# EAGLE design Wemos-ESP8266_MAX7219 v5 (EAGLE 9.6.2)
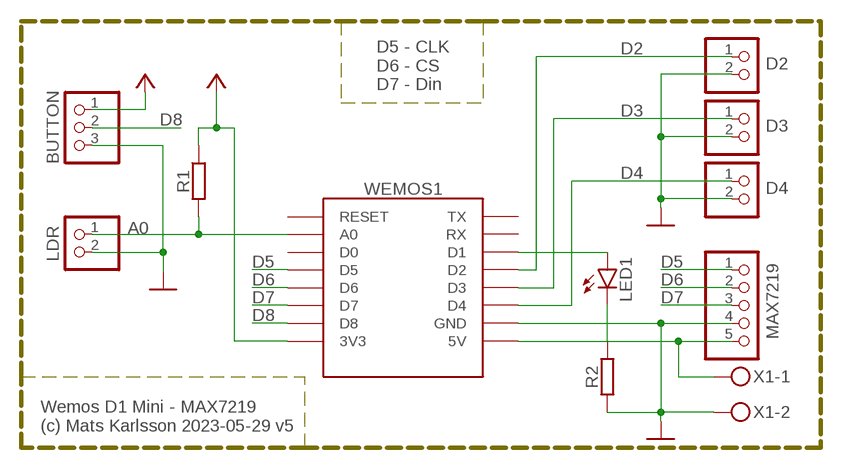
[diagram p0: schematic, sheet 1]

## Parts
BUTTON  PINHD-1X3  [1X03]
D2  PINHD-1X2  [1X02]
D3  PINHD-1X2  [1X02]
D4  PINHD-1X2  [1X02]
LDR  PINHD-1X2  [1X02]
LED1  LEDCHIPLED_1206  [CHIPLED_1206]
MAX7219  PINHD-1X5  [1X05]
R1  R-EU_M0805  [M0805]
R2  R-EU_M0805  [M0805]
WEMOS1  WEMOS-D1-MINI  [WEMOS-D1-MINI]
X1  W237-102  [W237-102]

## Nets
5V: MAX7219.5 WEMOS1.5V X1.1
A0: LDR.1 R1.2 WEMOS1.A0
D2: D2.1 WEMOS1.D2
D3: D3.1 WEMOS1.D3
D4: D4.1 WEMOS1.D4
D5: MAX7219.1 WEMOS1.D5
D6: MAX7219.2 WEMOS1.D6
D7: MAX7219.3 WEMOS1.D7
D8: BUTTON.2 WEMOS1.D8
GND: BUTTON.3 D2.2 D3.2 D4.2 LDR.2 MAX7219.4 R2.2 WEMOS1.GND X1.2
N$1: LED1.C R2.1
N$2: LED1.A WEMOS1.D1
VCC: BUTTON.1 R1.1 WEMOS1.3V3
Unconnected: WEMOS1.D0 WEMOS1.RESET WEMOS1.RX WEMOS1.TX

## Notes on the sheet
- D5 - CLK
  D6 - CS
  D7 - Din
- Wemos D1 Mini - MAX7219
  (c) Mats Karlsson 2023-05-29 v5

## Library data of the parts
BUTTON = pinhead:PINHD-1X3: PIN HEADER
D2-D4 LDR = pinhead:PINHD-1X2: PIN HEADER
LED1 = led:LED: LED OSRAM: - CHIPLED LG R971, LG N971, LY N971, LG Q971, LY Q971, LO R971, LY R971 LH N974, LH R974 LS Q976, LO Q976, LY Q976 LO Q996 - Hyper CHIPLED LW Q18S LB Q993, LB Q99A, LB R99A - SideLED LS A670, LO A670, LY A670, LG A670, LP A670 LB A673, LV A673, LT A673, LW A673 LH A674 LY A675 LS A676, LA A676, LO A676, LY A676, LW A676 LS A679, LY A679, LG A679 - Hyper Micro SIDELED® LS Y876, LA Y876, LO Y876, LY Y876 LT Y87S - SmartLED LW L88C, LW L88S LB L89C, LB L89S, LG L890 LS L89K, LO L89K, LY L89K LS L896, LA L896, LO L896, LY L896 - TOPLED LS T670, LO T670, LY T670, LG T670, LP T670 LSG T670, LSP T670, LSY T670, LOP T670, LYG T670 LG T671, LOG T671, LSG T671 LB T673, LV T673, LT T673, LW T673 LH T674 LS T676, LA T676, LO T676, LY T676, LB T676, LH T676, LSB T676, LW T676 LB T67C, LV T67C, LT T67C, LS T67K, LO T67K, LY T67K, LW E67C LS E67B, LA E67B, LO E67B, LY E67B, LB E67C, LV E67C, LT E67C LW T67C LS T679, LY T679, LG T679 LS T770, LO T770, LY T770, LG T770, LP T770 LB T773, LV T773, LT T773, LW T773 LH T774 LS E675, LA E675, LY E675, LS T675 LS T776, LA T776, LO T776, LY T776, LB T776 LHGB T686 LT T68C, LB T68C - Hyper Mini TOPLED® LB M676 - Mini TOPLED Santana® LG M470 LS M47K, LO M47K, LY M47K Source: http://www.osram.convergy.de LUXEON: - LUMILED® LXK2-PW12-R00, LXK2-PW12-S00, LXK2-PW14-U00, LXK2-PW14-V00 LXK2-PM12-R00, LXK2-PM12-S00, LXK2-PM14-U00 LXK2-PE12-Q00, LXK2-PE12-R00, LXK2-PE12-S00, LXK2-PE14-T00, LXK2-PE14-U00 LXK2-PB12-K00, LXK2-PB12-L00, LXK2-PB12-M00, LXK2-PB14-N00, LXK2-PB14-P00, LXK2-PB14-Q00 LXK2-PR12-L00, LXK2-PR12-M00, LXK2-PR14-Q00, LXK2-PR14-R00 LXK2-PD12-Q00, LXK2-PD12-R00, LXK2-PD12-S00 LXK2-PH12-R00, LXK2-PH12-S00 LXK2-PL12-P00, LXK2-PL12-Q00, LXK2-PL12-R00 Source: www.luxeon.com KINGBRIGHT: KA-3528ASYC Source: www.kingbright.com
MAX7219 = pinhead:PINHD-1X5: PIN HEADER
R1 R2 = rcl:R-EU_: RESISTOR, European symbol; SPICEPREFIX: R
WEMOS1 = esp8266modules:WEMOS-D1-MINI: WeMos.cc D1 mini ESP8266 module
X1 = con-wago-500:W237-102: WAGO SCREW CLAMP; MPN: 237-102; OC_FARNELL: unknown; OC_NEWARK: 70K9898

## Board
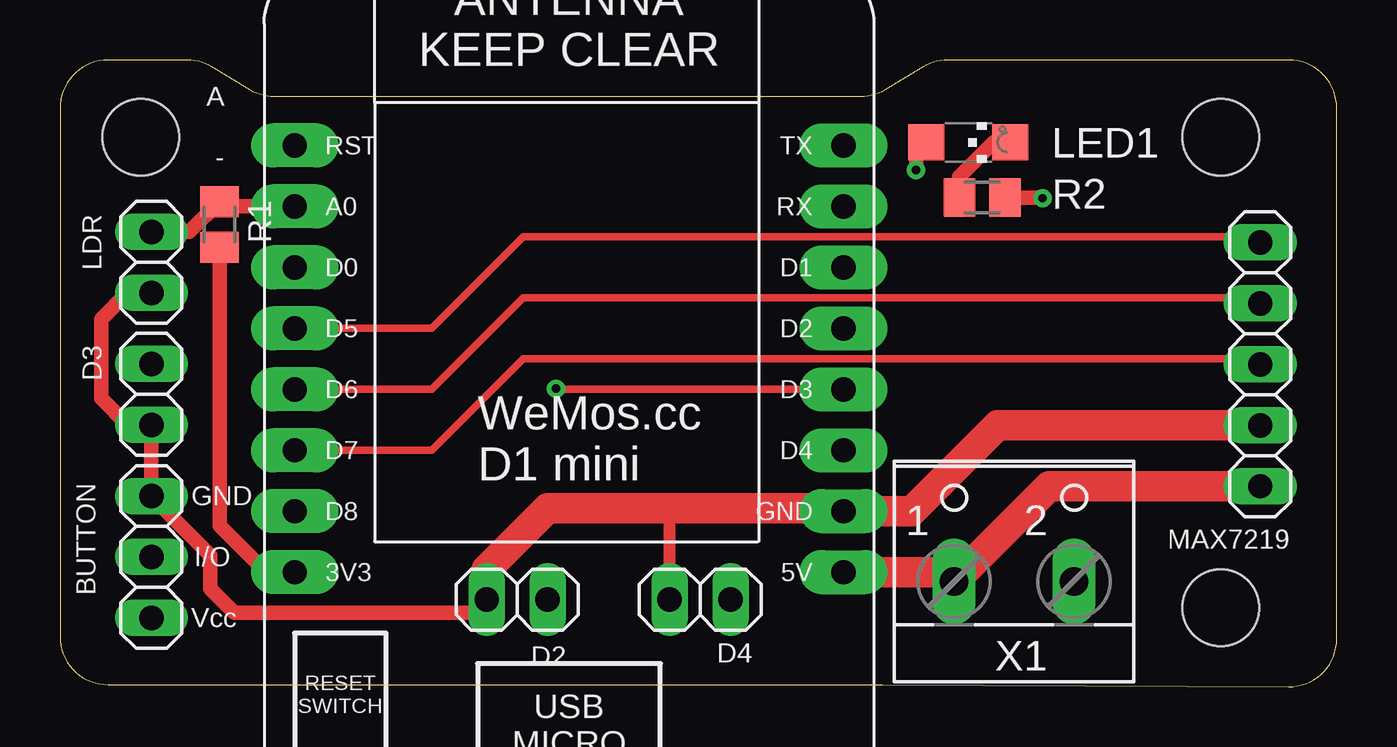
[diagram p1: board, top side]
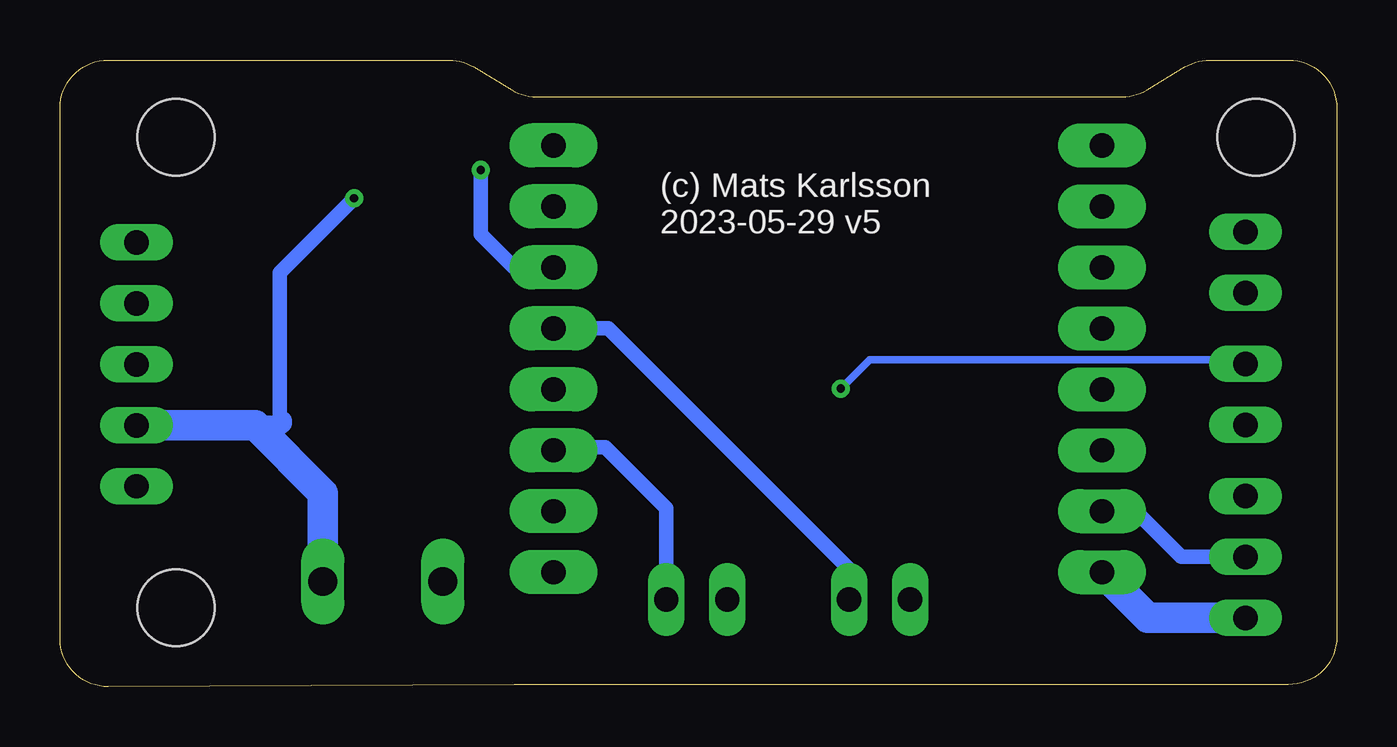
[diagram p2: board, bottom side, seen from below]

Size 53.2 x 26.11 mm. Coordinates in mm from the lower left corner, seen from the top.
Outline: 0,24.11 0,2.09 arc90 2.01,0.09 2.27,0.09 34.27,0.09 51.19,0 arc90 53.2,2 53.2,24.11 arc90 51.2,26.11 37,26.11 arc31 35.96,25.83 34.39,24.87 arc-31 33.35,24.58 8.94,24.58 arc-31 7.9,24.87 6.33,25.83 arc31 5.29,26.11 2,26.11 arc90 0,24.11
Copper layers (1*16): Top 0.035mm / dielectric 1.5mm / Bottom 0.035mm
Design rules "default": minimum track width 6mil, minimum drill 0.35mm, track to track 6mil, track to pad 6mil, pad to pad 6mil, via to via 6mil, smd to smd 6mil, copper to edge 40mil, drill to drill 6mil, minimum pad ring 10mil, minimum via ring 8mil, stop-mask expansion 4mil, vias tented up to drill 0mil, thermal gap 10mil
Holes 3.2 mm at 48.37,3.29 48.37,22.89 3.37,22.89

### Footprints (pad centres in the part's own frame; a part is rotated, then mirrored left to right if it is on the bottom)
1X03 = drill 1.016 long: 1 -2.54,0; 2 0,0; 3 2.54,0
1X02 = drill 1.016 long: 1 -1.27,0; 2 1.27,0
CHIPLED_1206 = smd 1.5 x 1.5: A 0,-1.75; C 0,1.75
1X05 = drill 1.016 long: 1 -5.08,0; 2 -2.54,0; 3 0,0; 4 2.54,0; 5 5.08,0
M0805 = smd 1.3 x 1.6: 1 -0.95,0; 2 0.95,0
WEMOS-D1-MINI = drill 1.016 pad 1.829 long: 3V3 -10.16,-10.16; 5V 12.7,-10.16; A0 -10.16,5.08; D0 -10.16,2.54; D1 12.7,2.54; D2 12.7,0; D3 12.7,-2.54; D4 12.7,-5.08; D5 -10.16,0; D6 -10.16,-2.54; D7 -10.16,-5.08; D8 -10.16,-7.62; GND 12.7,-7.62; RESET -10.16,7.62; RX 12.7,5.08; TX 12.7,7.62
W237-102 = drill 1.194 long: 1 -2.5,-1.27; 2 2.5,-1.27

### Placement (x,y rotation side)
BUTTON  3.81,5.41 90 top
D2  19.05,3.63 180 top
D3  3.81,12.18 270 top
D4  26.67,3.63 180 top
LDR  3.81,17.68 270 top
LED1  37.85,22.68 270 top
MAX7219  50.01,13.43 270 top
R1  6.65,19.26 90 top
R2  38.43,20.38 0 top
WEMOS1  19.94,14.93 0 top
X1  39.75,5.66 0 top

### Tracks (layer width: path | path; a pad name or v marks a point on that pad's centre or on a via)
5V
  Top 1.016: 37.08,4.77 37.25,4.61 X1.1
  Top 1.27: WEMOS1.5V 37.08,4.77 | X1.1 41.21,8.35 MAX7219.5
A0
  Top 0.61: LDR.1 5.39,18.95 R1.2 6.85,20.01 WEMOS1.A0
D2
  Bottom 0.61: D2.1 20.32,4.9 30.35,14.93 WEMOS1.D2
D3  (via drill 0.35)
  Top 0.305: WEMOS1.D3 20.7,12.39 v20.67,12.42
  Bottom 0.305: v20.67,12.42 19.47,13.62 3.98,13.62 D3.1 4.92,13.45
D4
  Bottom 0.406: 32.51,9.98 WEMOS1.D4
  Bottom 0.61: D4.1 27.94,7.44 30.48,9.98 32.51,9.98
D5
  Top 0.305: MAX7219.1 49.78,18.74 19.3,18.74 15.49,14.93 WEMOS1.D5
D6
  Top 0.305: MAX7219.2 49.78,16.2 19.3,16.2 15.49,12.39 WEMOS1.D6
D7
  Top 0.305: MAX7219.3 49.78,13.66 19.3,13.66 15.49,9.85 WEMOS1.D7
D8
  Bottom 0.61: BUTTON.2 6.48,5.41 8.38,7.31 WEMOS1.D8
GND  (via drill 0.35)
  Top 0.508: D4.2 25.4,7.41 25.37,7.44
  Top 0.61: v40.94,20.36 40.92,20.38 R2.2 | WEMOS1.GND 32.51,7.44 | D2.2 17.24,3.09 7.27,3.09 6.27,4.09 6.27,5.49 BUTTON.3 D3.2 2.81,10.91 1.71,12.01 1.71,15.31 2.81,16.41 LDR.2
  Top 1.27: 32.51,7.44 25.37,7.44 20.32,7.44 17.78,4.9 D2.2 | WEMOS1.GND 35.49,7.31 39.07,10.89 MAX7219.4
  Bottom 0.61: v40.94,20.36 44.04,17.26 44.04,10.89 | 43.94,11.09 43.94,10.99 43.94,10.89
  Bottom 0.813: 44.04,10.89 43.94,10.99 | 43.94,11.09 44.14,10.89 45.07,10.89
  Bottom 1.27: X1.2 42.25,8.07 45.07,10.89 MAX7219.4
  other vias: 17.78,3.63
N$1
  Top 0.61: R2.1 37.48,21.26 38.9,22.68 LED1.C
N$2  (via drill 0.35)
  Top 0.508: LED1.A 35.67,22.25
  Top 0.61: 35.67,22.25 v35.67,21.53
  Bottom 0.61: WEMOS1.D1 34.29,17.47 35.67,18.85 v35.67,21.53
VCC
  Top 0.61: R1.1 6.65,6.71 8.59,4.77 WEMOS1.3V3
  Bottom 1.27: BUTTON.1 7.87,2.87 WEMOS1.3V3

### Text on the board
tPlace: A | - | GND | I/O | Vcc
bPlace: (c) Mats Karlsson / 2023-05-29 v5
tValues: CLK - D5 | CS - D6 | Din - D7 | + | GND | - | Vcc | GND | D2 | GND | D4
bValues: CLK - D5 | CS - D6 | Din - D7 | GND | Vcc
Document: (c) Mats Karlsson / 2023-05-29 v5 | D5 - CLK / D6 - CS / D7 - Din | D5 - CLK / D6 - CS / D7 - Din / GND / Vcc